# Altium project CW6680E LQFP48 BT Boombox S10 V1.0.PrjPCB
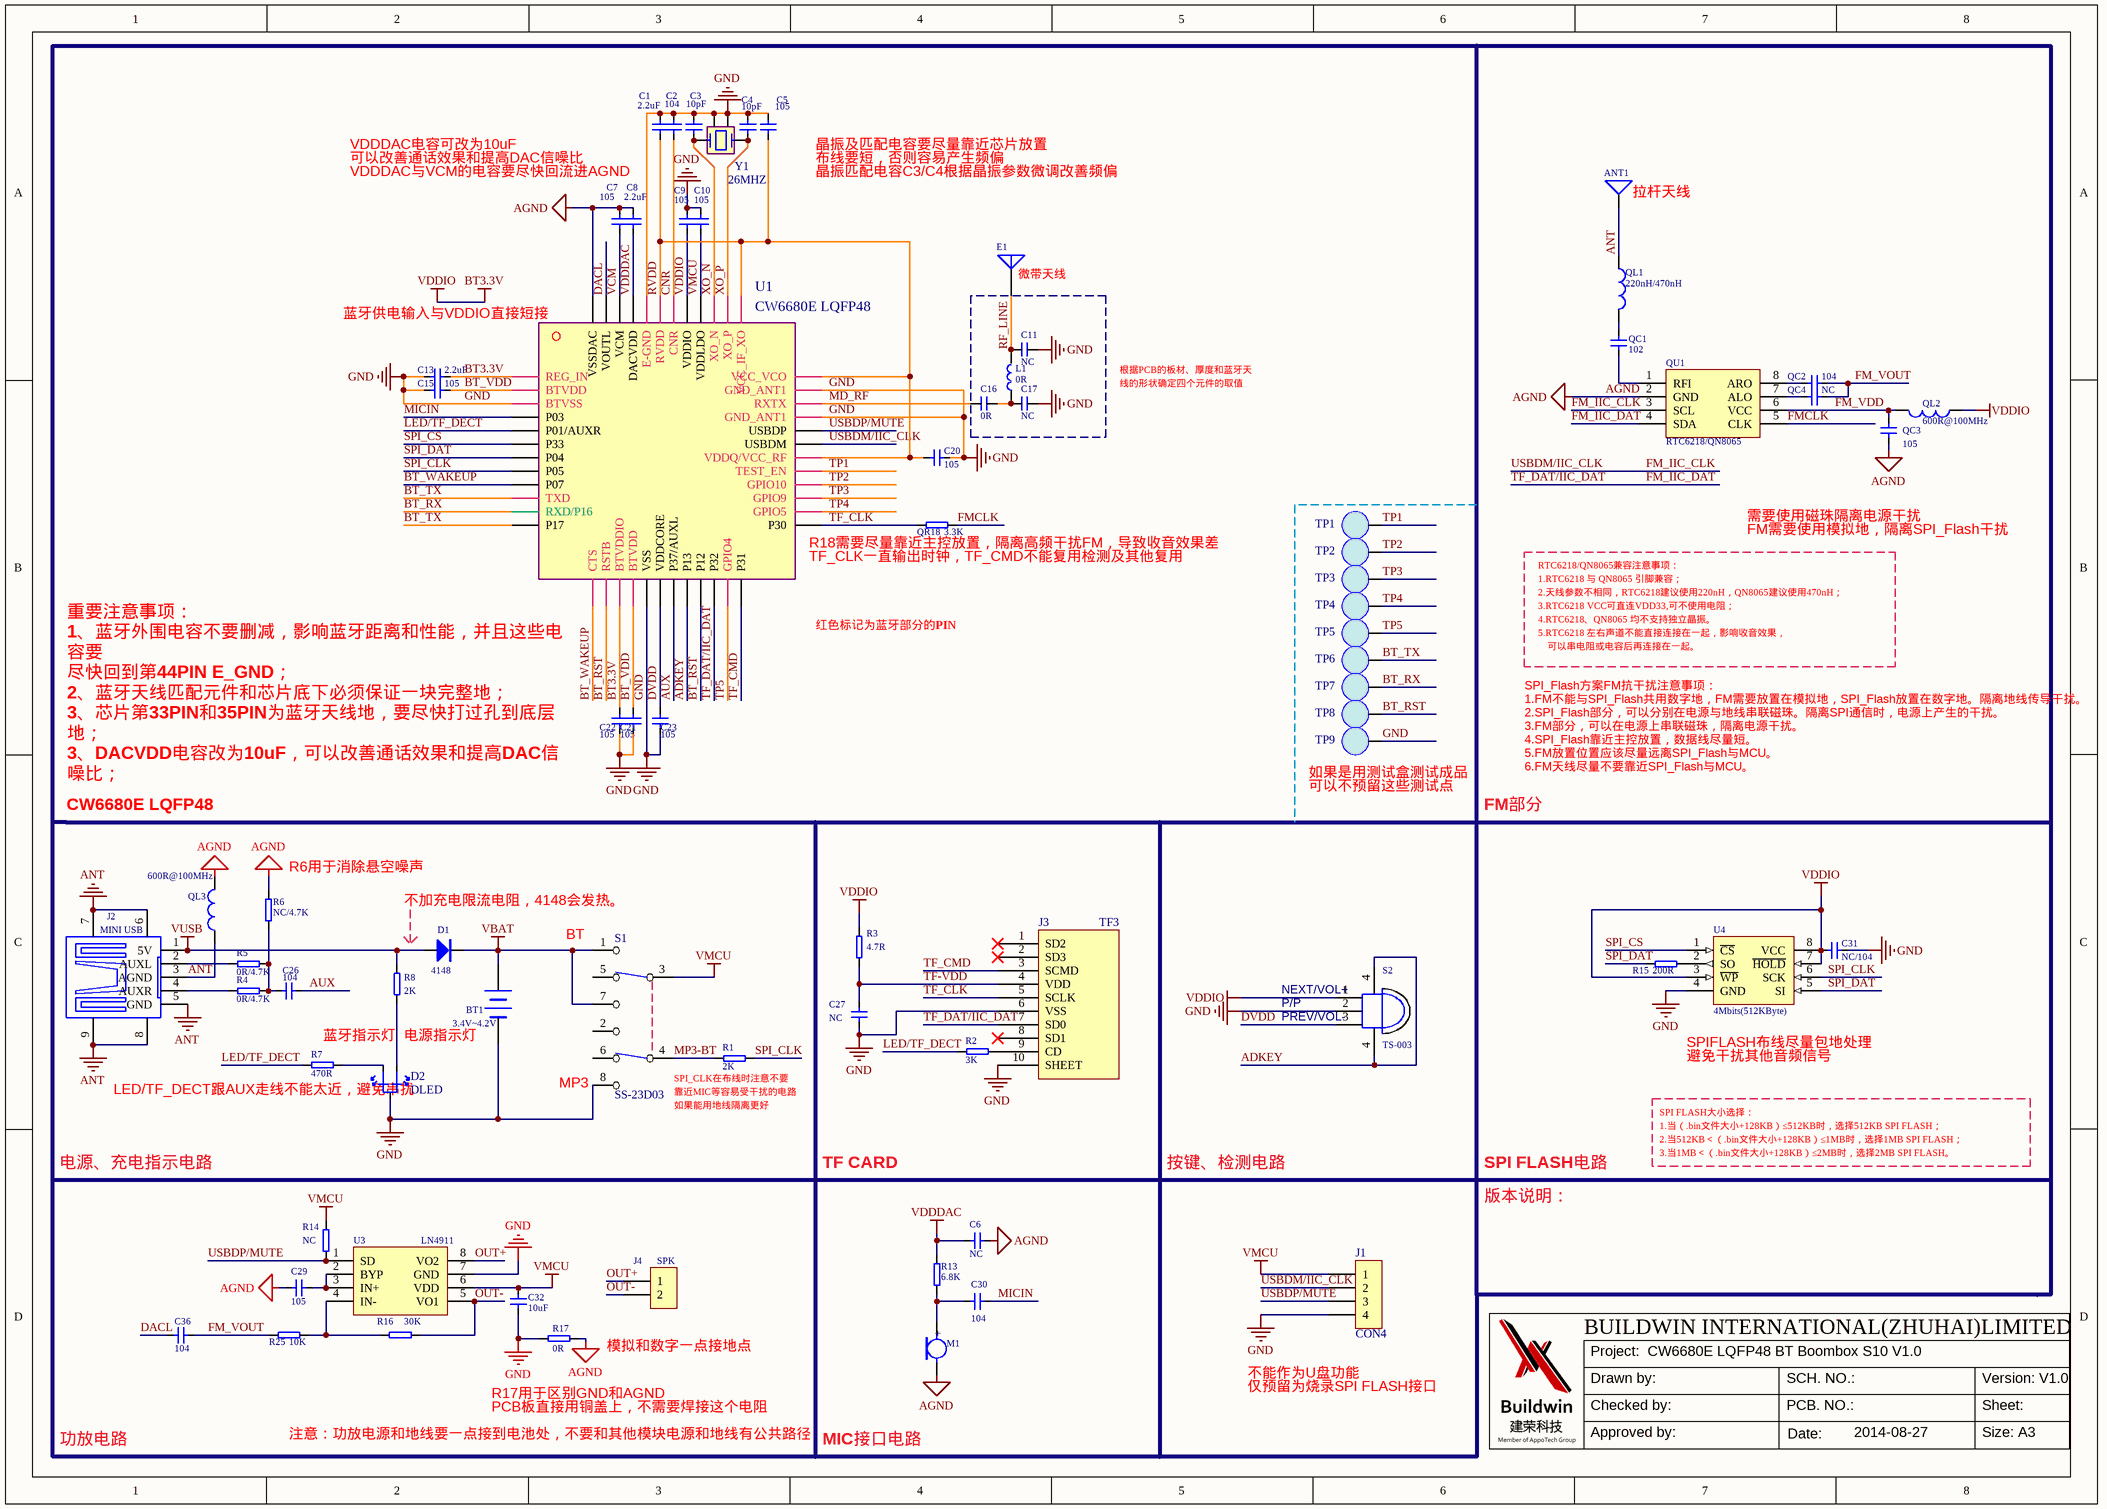
[diagram p0: CW6680E LQFP48 BT Boombox S10 V1.0.SchDoc]
1 sheet, 75 parts. Net scope: global (net labels, ports and power ports of the same name join across sheets).
Board file: CW6680E LQFP48 BT Boombox S10 V1.0.PcbDoc

## Sheet CW6680E LQFP48 BT Boombox S10 V1.0.SchDoc
size A3; SheetNumber: 0; SheetTotal: 0

### Parts
ANT1  (no value)  [ANT]
BT1  3.4V~4.2V  [SIP2]
C1  2.2uF  [C0603]
C2  104  [C0603]
C3  10pF  [C0603]
C4  10pF  [C0603]
C5  105  [C0603]
C6  NC  [C0603]
C7  105  [C0603]
C8  2.2uF  [C0603]
C9  105  [C0603]
C10  105  [C0603]
C11  NC  [C0603]
C13  2.2uF  [C0603]
C15  105  [C0603]
C16  0R  [C0603]
C17  NC  [C0603]
C20  105  [C0603]
C21  105  [C0603]
C22  105  [C0603]
C23  105  [C0603]
C26  104  [C0603]
C27  NC  [C0603]
C29  105  [C0603]
C30  104  [C0603]
C31  NC/104  [C0603]
C32  10uF  [C0805]
C36  104  [C0603]
D1  4148  [DO-214]
D2  DLED  [LED-R&B]
E1  (no value)  [ant_pifa]
J1  CON4  [SIP4]
J2  MINI USB  [MINI-USB-B]
J3  TF3  [TFCARD]
J4  SPK  [SIP2]
L1  0R  [L0603]
M1  MIC  [MIC-4022]  (value not drawn)
QC1  102  [C0603]
QC2  104  [C0603]
QC3  105  [C0603]
QC4  NC  [C0603]
QL1  220nH/470nH  [L0603]
QL2  600R@100MHz  [L0603]
QL3  600R@100MHz  [L0603]
QR18  3.3K  [R0603]
QU1  RTC6218/QN8065  [SO-8]
R1  2K  [R0603]
R2  3K  [R0603]
R3  4.7R  [R0603]
R4  0R/4.7K  [R0603]
R5  0R/4.7K  [R0603]
R6  NC/4.7K  [R0603]
R7  470R  [R0603]
R8  2K  [R0603]
R13  6.8K  [R0603]
R14  NC  [R0603]
R15  200R  [R0603]
R16  30K  [R0603]
R17  0R  [R0603]
R25  10K  [R0603]
S1  SS-23D03  [3ND]
S2  TS-003  [KEY_BL]
TP1  TestPoint  [TP01]  (value not drawn)
TP2  TestPoint  [TP01]  (value not drawn)
TP3  TestPoint  [TP01]  (value not drawn)
TP4  TestPoint  [TP01]  (value not drawn)
TP5  TestPoint  [TP01]  (value not drawn)
TP6  TestPoint  [TP01]  (value not drawn)
TP7  TestPoint  [TP01]  (value not drawn)
TP8  TestPoint  [TP01]  (value not drawn)
TP9  TestPoint  [TP01]  (value not drawn)
U1  CW6680E LQFP48  [LQFP48-7*7]
U3  LN4911  [SO-8]
U4  4Mbits(512KByte)  [SO-8/8W]
Y1  26MHZ  [26m]

### Blocks framed on the sheet
微带天线: C11 C16 C17 L1

### Nets
AGND: C6.2 C7.1 C8.1 C29.2 M1.2 QC3.2 QL3.1 QU1.2(GND) R6.2 R17.2 U1.48(VSSDAC)
ANT: ANT1.1 J2.3(AGND) J2.5(GND) J2.6 J2.7 J2.8 J2.9 QL1.1 QL3.2
BT3.3V: C9.2 C13.2 C22.1 C31.2 QL2.2 R3.2 S2.1 U1.1(REG_IN) U1.15(BTVDDIO) U1.41(VDDIO) U4.3(~{WP}) U4.7(~{HOLD}) U4.8(VCC)  [also labelled VDDIO]
GND: BT1.2(-) C1.2 C2.2 C3.1 C4.1 C5.1 C9.1 C10.1 C11.2 C13.1 C15.1 C17.2 C20.2 C21.2 C22.2 C23.2 C27.2 C31.1 C32.1 D2.2 J1.4 J3.6(VSS) J3.10(SHEET) R17.1 S1.8 S2.2 TP9.1 U1.3(BTVSS) U1.17(VSS) U1.33(GND_ANT1) U1.35(GND_ANT1) U1.44(E-GND) U3.7(GND) U4.4(GND) Y1.2 Y1.4
VBAT: BT1.1(+) D1.2(K) S1.1 S1.7
VDDDAC: C6.1 C8.2 R13.1 U1.45(DACVDD)
VMCU: C10.2 C32.2 J1.1 R14.2 S1.3 U1.40(VDDLDO) U3.6(VDD)
VUSB: D1.1(A) J2.1(5V) R8.2
ADKEY: S2.4 U1.20(P13)
AUX: C26.1 U1.19(P37/AUXL)
BT_RST: TP8.1 U1.14(RSTB) U1.21(P12)
BT_RX: TP7.1 U1.11(RXD/P16)
BT_TX: TP6.1 U1.10(TXD) U1.12(P17)
BT_VDD: C15.2 C21.1 U1.2(BTVDD) U1.16(BTVDD)
BT_WAKEUP: U1.9(P07) U1.13(CTS)
CNR: C2.1 U1.42(CNR)
DACL: C36.1 U1.47(VOUTL)
DVDD: C23.1 S2.3 U1.18(VDDCORE)
FM_IIC_CLK: J1.2 QU1.3(SCL) U1.31(USBDM)  [also labelled USBDM/IIC_CLK]
FM_IIC_DAT: J3.7(SD0) QU1.4(SDA) U1.22(P32)  [also labelled TF_DAT/IIC_DAT]
FM_VDD: QC3.1 QL2.1 QU1.6(VCC)
FM_VOUT: C36.2 QC2.1 QC4.1 R25.2
FMCLK: QR18.1 QU1.5(CLK)
LED/TF_DECT: R2.1 R7.2 U1.5(P01/AUXR)
MD_RF: C16.2 U1.34(RXTX)
MICIN: C30.1 U1.4(P03)
MP3-BT: R1.2 S1.4
OUT+: J4.1 U3.8(VO2)
OUT-: J4.2 R16.1 U3.5(VO1)
RF_LINE: C11.1 E1.1(A) L1.2
RVDD: C1.1 C5.2 C20.1 U1.30(VDDQ/VCC_RF) U1.36(VCC_VCO) U1.37(VCC_IF_XO) U1.43(RVDD)
SPI_CLK: R1.1 U1.8(P05) U4.6(SCK)
SPI_CS: U1.6(P33) U4.1(~{CS})
SPI_DAT: R15.2 U1.7(P04) U4.5(SI)
TF-VDD: C27.1 J3.4(VDD) R3.1
TF_CLK: J3.5(SCLK) QR18.2 U1.25(P30)
TF_CMD: J3.3(SCMD) U1.24(P31)
TP1: TP1.1 U1.29(TEST_EN)
TP2: TP2.1 U1.28(GPIO10)
TP3: TP3.1 U1.27(GPIO9)
TP4: TP4.1 U1.26(GPIO5)
TP5: TP5.1 U1.23(GPIO4)
USBDP/MUTE: J1.3 R14.1 U1.32(USBDP) U3.1(SD)
VCM: C7.2 U1.46(VCM)
XO_N: C3.2 U1.39(XO_N) Y1.1
XO_P: C4.2 U1.38(XO_P) Y1.3
NetC16_1: C16.1 C17.1 L1.1
NetC26_2: C26.2 R4.1 R5.1 R6.1
NetC29_1: C29.1 U3.2(BYP) U3.3(IN+)
NetC30_2: C30.2 M1.1 R13.2
NetD2_1: D2.1 R7.1
NetD2_3: D2.3 R8.1
NetJ2_2: J2.2(AUXL) R5.2
NetJ2_4: J2.4(AUXR) R4.2
NetJ3_9: J3.9(CD) R2.2
NetQC1_1: QC1.1 QU1.1(RFI)
NetQC1_2: QC1.2 QL1.2
NetQC2_2: QC2.2 QU1.8(ARO)
NetQC4_2: QC4.2 QU1.7(ALO)
NetR15_1: R15.1 U4.2(SO)
NetR16_2: R16.2 R25.1 U3.4(IN-)

Not connected (* = marked no-connect by the designer): J3 1(SD2)* 2(SD3)* 8(SD1)*; S1 2 5 6

### Notes on the sheet
- VDDDAC电容可改为10uF
- 可以改善通话效果和提高DAC信噪比
- VDDDAC与VCM的电容要尽快回流进AGND
- 晶振匹配电容C3/C4根据晶振参数微调改善频偏
- 晶振及匹配电容要尽量靠近芯片放置
- 布线要短，否则容易产生频偏
- (near ANT1) 拉杆天线
- 蓝牙供电输入与VDDIO直接短接
- 根据PCB的板材、厚度和蓝牙天
- 线的形状确定四个元件的取值
- TF_CLK一直输出时钟，TF_CMD不能复用检测及其他复用
- R18需要尽量靠近主控放置，隔离高频干扰FM，导致收音效果差
- 1.RTC6218 与 QN8065 引脚兼容；
- RTC6218/QN8065兼容注意事项：
- FM需要使用模拟地，隔离SPI_Flash干扰
- 需要使用磁珠隔离电源干扰
- (near U1) 红色标记为蓝牙部分的PIN
- 4.RTC6218、QN8065 均不支持独立晶振。
- 2.天线参数不相同，RTC6218建议使用220nH，QN8065建议使用470nH；
- 3.RTC6218 VCC可直连VDD33,可不使用电阻；
- 5.RTC6218 左右声道不能直接连接在一起，影响收音效果，
- 可以串电阻或电容后再连接在一起。
- SPI_Flash方案FM抗干扰注意事项：
- 2.SPI_Flash部分，可以分别在电源与地线串联磁珠。隔离SPI通信时，电源上产生的干扰。
- 1.FM不能与SPI_Flash共用数字地，FM需要放置在模拟地，SPI_Flash放置在数字地。隔离地线传导干扰。
- (near U1) 重要注意事项：
  1、蓝牙外围电容不要删减，影响蓝牙距离和性能，并且这些电容要
  尽快回到第44PIN E_GND；
  2、蓝牙天线匹配元件和芯片底下必须保证一块完整地；
  3、芯片第33PIN和35PIN为蓝牙天线地，要尽快打过孔到底层地；
  3、DACVDD电容改为10uF，可以改善通话效果和提高DAC信噪比；
  4、DACVDD和VCM电容要靠近相应引脚，并且要以最短路径回到
  第48PIN VSSDAC；
  5、蓝牙晶振及匹配电容要尽量靠近芯片放置。
- (near TP9) 如果是用测试盒测试成品
- 3.FM部分，可以在电源上串联磁珠，隔离电源干扰。
- 4.SPI_Flash靠近主控放置，数据线尽量短。
- 5.FM放置位置应该尽量远离SPI_Flash与MCU。
- 6.FM天线尽量不要靠近SPI_Flash与MCU。
- CW6680E LQFP48
- (near TP9) 可以不预留这些测试点
- FM部分
- (near R6) R6用于消除悬空噪声
- 不加充电限流电阻，4148会发热。
- (near S1) BT
- (near S2) NEXT/VOL+
- (near R7) 蓝牙指示灯
- 电源指示灯
- P/P
- (near S2) PREV/VOL-
- (near U4) SPIFLASH布线尽量包地处理
- (near R7) LED/TF_DECT跟AUX走线不能太近，避免串扰
- (near S1) MP3
- SPI_CLK在布线时注意不要
- 靠近MIC等容易受干扰的电路
- 如果能用地线隔离更好
- 1.当（.bin文件大小+128KB）≤512KB时，选择512KB SPI FLASH；
- SPI FLASH大小选择：
- 避免干扰其他音频信号
- 电源、充电指示电路
- TF CARD
- 按键、检测电路
- SPI FLASH电路
- 2.当512KB＜（.bin文件大小+128KB）≤1MB时，选择1MB SPI FLASH；
- 3.当1MB＜（.bin文件大小+128KB）≤2MB时，选择2MB SPI FLASH。
- 版本说明：
- (near R17) R17用于区别GND和AGND
- 模拟和数字一点接地点
- 不能作为U盘功能
- 仅预留为烧录SPI FLASH接口
- BUILDWIN INTERNATIONAL(ZHUHAI)LIMITED
- Project:  CW6680E LQFP48 BT Boombox S10 V1.0
- Drawn by:
- SCH. NO.:
- Version: V1.0
- 功放电路
- 注意：功放电源和地线要一点接到电池处，不要和其他模块电源和地线有公共路径
- PCB板直接用铜盖上，不需要焊接这个电阻
- MIC接口电路
- Checked by:
- Approved by:
- PCB. NO.:
- Date:
- 2014-08-27
- Sheet:
- Size: A3
- (in symbol MICROPHONE2) +

### Library data of the parts
ANT1 = ANT
BT1 = BATTERY
C1-C10 C13 C15 C20-C23 C26 C27 C29-C32 C36 QC1-QC4 = CAP: Capacitor
C11 C17 = CAP_C: 0402 CER CAP NCpF 50V +/-10%
C16 = CAP_C: 0402 CER CAP ?pF 50V +/-10%
D1 = DIODE
D2 = DLED: 双色灯 插件 共阴
E1 = Antenna: Generic Antenna; Published: 24-Mar-1999; LatestRevisionDate: 17-Jul-2002; LatestRevisionNote: Re-released for DXP Platform.; PackageReference: PIN1; Publisher: Altium Limited
J1 = CON4: Connector
J2 = Mini USB-F
J3 = TF
J4 = CON2: Connector
L1 = INDUCTOR: 0 OHM
M1 = MICROPHONE2: Microphone
QL1-QL3 = INDUCTOR
QR18 R1-R8 R13-R17 R25 = RES2
QU1 = QN8075
S1 = SW-DPST: pin to pad: A1>1 A2>9
U1 = BT8202
U3 = 4871
U4 = SPI FLASH